# Altium project MIDIPiano.PrjPcb
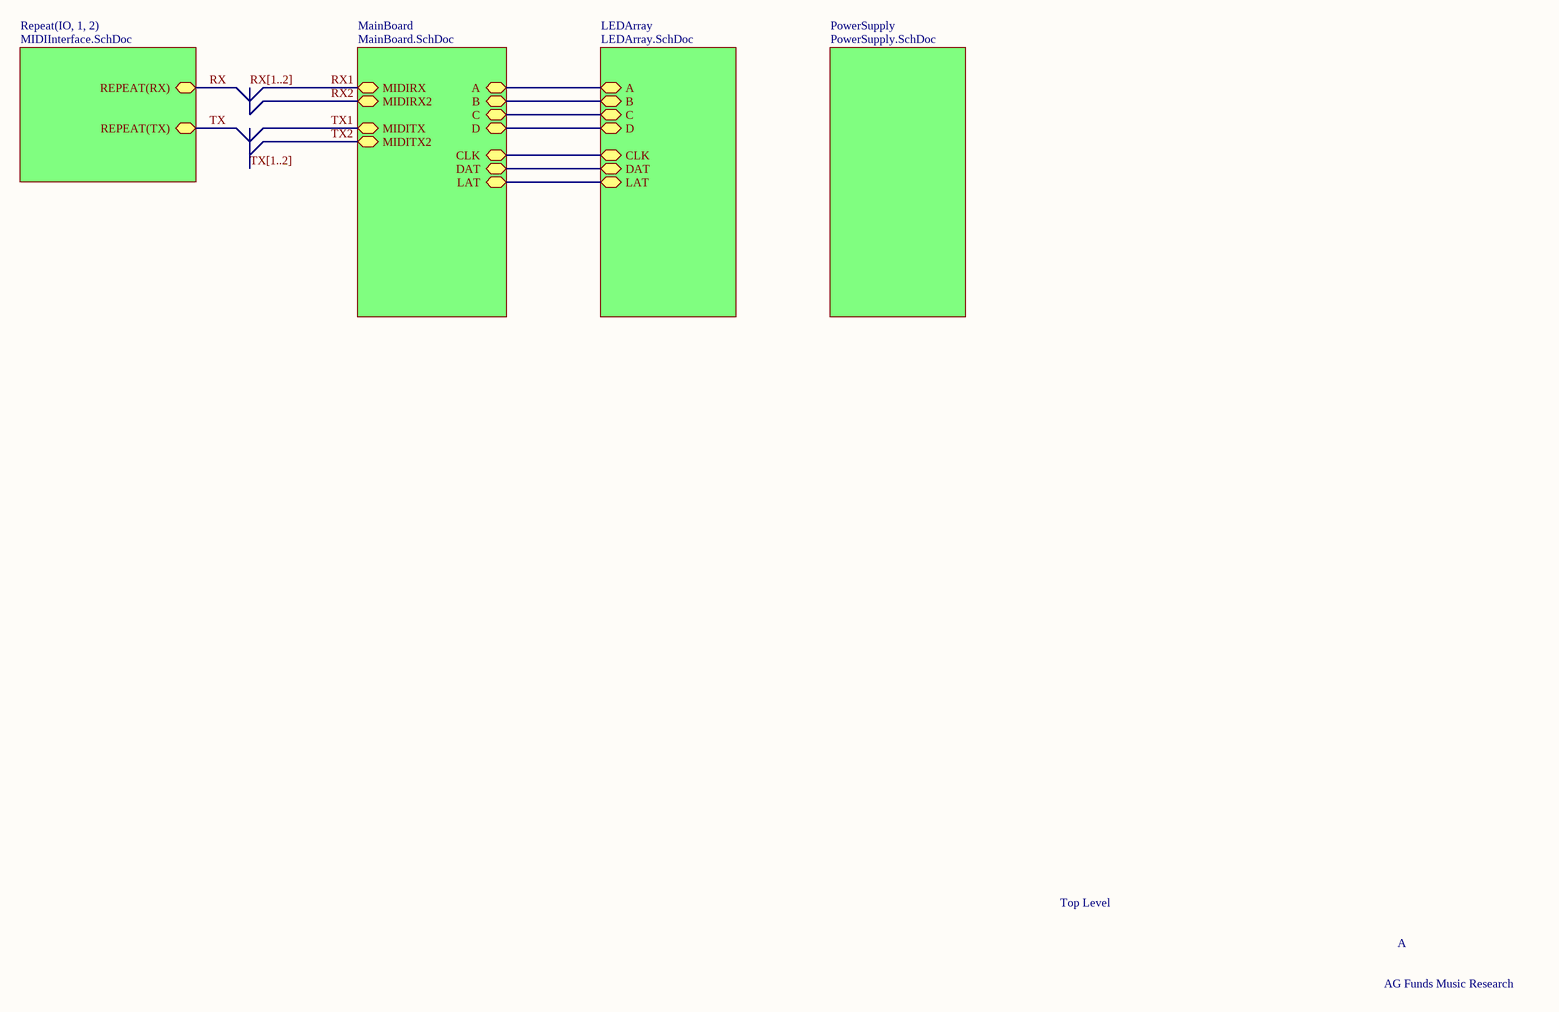
[diagram p0: MIDIPianoTop.SchDoc]
7 sheets, 250 parts. Net scope: hierarchical (ports join the sheet entries above them; power ports are global).
Board files: LEDArray8KeyRevB.PcbDoc, MainBoard.PcbDoc, LEDArrayFPC_24LED.PcbDoc
Sheets:
  MIDIPianoTop.SchDoc
    LEDArray = LEDArray.SchDoc
      LED1 = LEDElement.SchDoc
      NPNA = NPNTransistorArray.SchDoc
      NPNB = NPNTransistorArray.SchDoc
      NPNC = NPNTransistorArray.SchDoc
    MainBoard = MainBoard.SchDoc
    PowerSupply = PowerSupply.SchDoc
    IO1 = MIDIInterface.SchDoc
    IO2 = MIDIInterface.SchDoc

## Sheet MIDIPianoTop.SchDoc
size A3; DrawnBy: AG Funds Music Research Dept.; SheetNumber: 1

### Sub-sheets
LEDArray = LEDArray.SchDoc: A, B, C, D, CLK, LAT, DAT
MainBoard = MainBoard.SchDoc: A, B, C, D, CLK, LAT, DAT, MIDIRX, MIDITX, MIDIRX2, MIDITX2
PowerSupply = PowerSupply.SchDoc: no entries
Repeat(IO, 1, 2) = MIDIInterface.SchDoc: REPEAT(RX), REPEAT(TX)

### Nets
A: sheet LEDArray/A, sheet MainBoard/A
B: sheet LEDArray/B, sheet MainBoard/B
C: sheet LEDArray/C, sheet MainBoard/C
CLK: sheet LEDArray/CLK, sheet MainBoard/CLK
D: sheet LEDArray/D, sheet MainBoard/D
DAT: sheet LEDArray/DAT, sheet MainBoard/DAT
LAT: sheet LEDArray/LAT, sheet MainBoard/LAT
RX: sheet Repeat(IO, 1, 2)/REPEAT(RX)
TX: sheet Repeat(IO, 1, 2)/REPEAT(TX)

### Buses and harness runs
bus RX[1..2]
bus TX[1..2]

### Notes on the sheet
- Top Level
- A
- AG Funds Music Research

## Sheet LEDArray.SchDoc
size A2; SheetNumber: 3
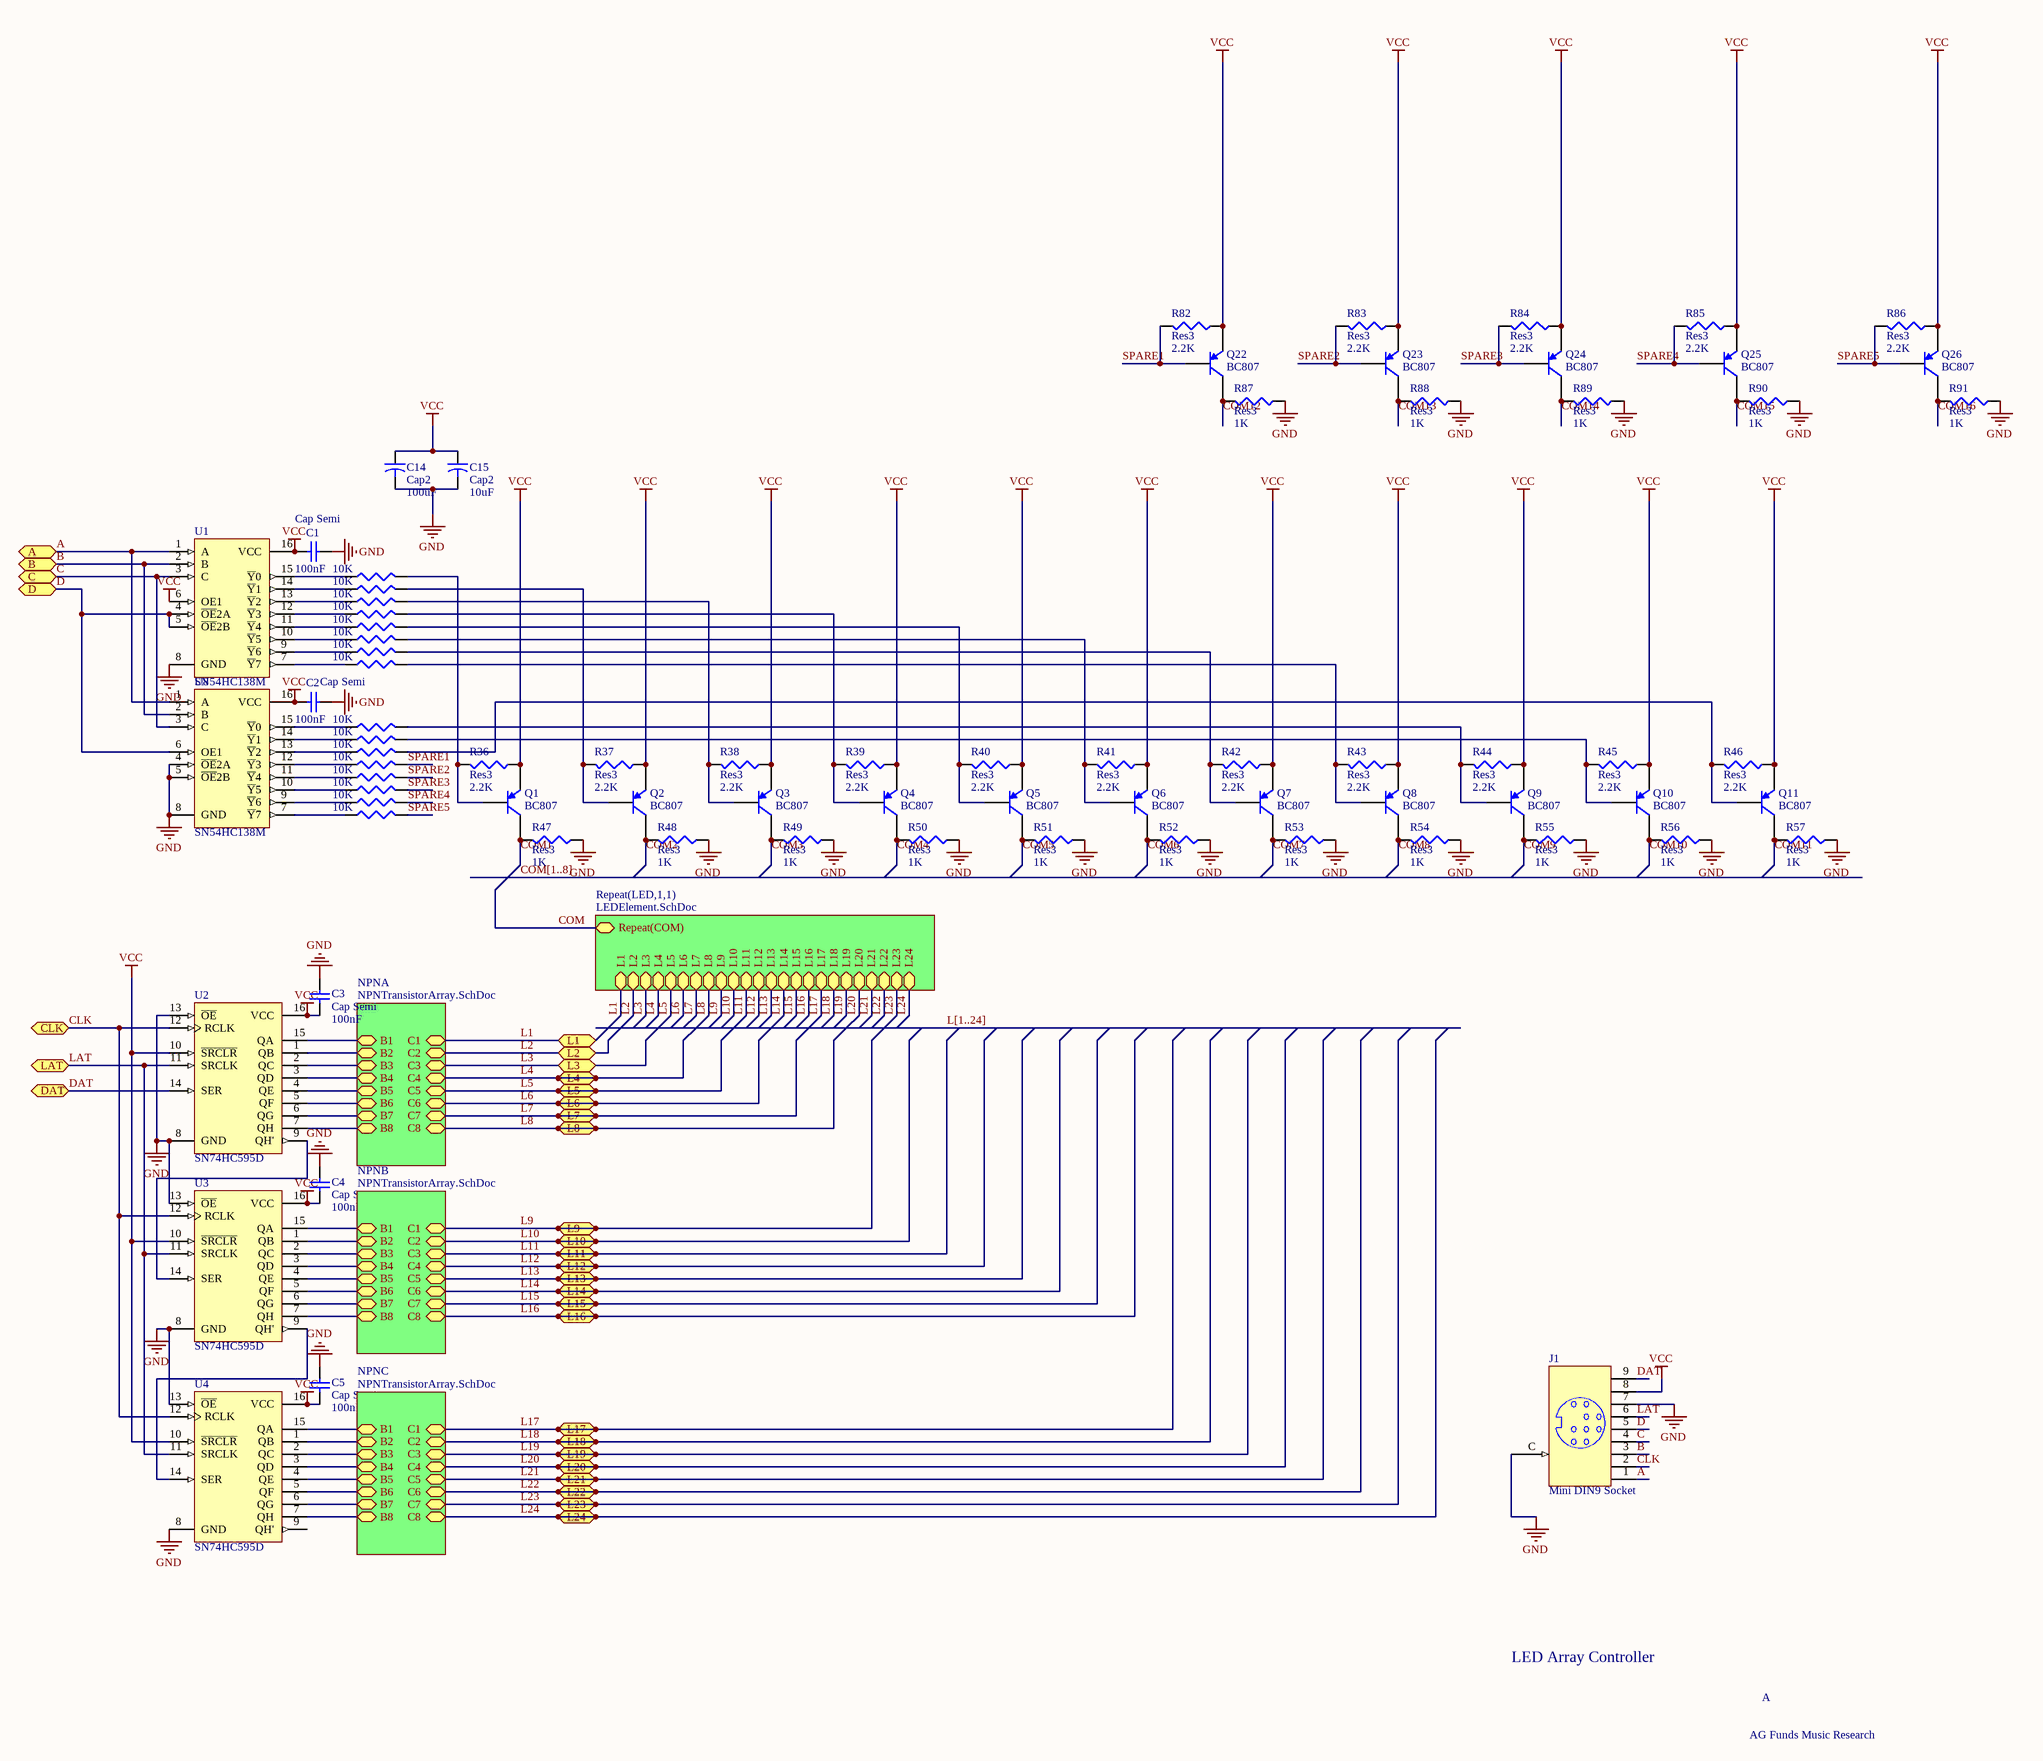
[diagram p1: LEDArray.SchDoc]

### Parts
C1  Cap Semi  value 100nF  [1608[0603]]
C2  Cap Semi  value 100nF  [1608[0603]]
C3  Cap Semi  value 100nF  [1608[0603]]
C4  Cap Semi  value 100nF  [1608[0603]]
C5  Cap Semi  value 100nF  [1608[0603]]
C14  Cap2  value 100uF  [CAPR5-4X5]
C15  Cap2  value 10uF  [CAPR5-4X5]
J1  Mini DIN9 Socket  [9miniDIN]
Q1  BC807  [SOT23-3M]
Q2  BC807  [SOT23-3M]
Q3  BC807  [SOT23-3M]
Q4  BC807  [SOT23-3M]
Q5  BC807  [SOT23-3M]
Q6  BC807  [SOT23-3M]
Q7  BC807  [SOT23-3M]
Q8  BC807  [SOT23-3M]
Q9  BC807  [SOT23-3M]
Q10  BC807  [SOT23-3M]
Q11  BC807  [SOT23-3M]
Q22  BC807  [SOT23-3M]
Q23  BC807  [SOT23-3M]
Q24  BC807  [SOT23-3M]
Q25  BC807  [SOT23-3M]
Q26  BC807  [SOT23-3M]
R25  value 10K  [J1-0603]  (hidden comment: Res3)
R26  value 10K  [J1-0603]  (hidden comment: Res3)
R27  value 10K  [J1-0603]  (hidden comment: Res3)
R28  value 10K  [J1-0603]  (hidden comment: Res3)
R29  value 10K  [J1-0603]  (hidden comment: Res3)
R30  value 10K  [J1-0603]  (hidden comment: Res3)
R31  value 10K  [J1-0603]  (hidden comment: Res3)
R32  value 10K  [J1-0603]  (hidden comment: Res3)
R33  value 10K  [J1-0603]  (hidden comment: Res3)
R34  value 10K  [J1-0603]  (hidden comment: Res3)
R35  value 10K  [J1-0603]  (hidden comment: Res3)
R36  Res3  value 2.2K  [J1-0603]
R37  Res3  value 2.2K  [J1-0603]
R38  Res3  value 2.2K  [J1-0603]
R39  Res3  value 2.2K  [J1-0603]
R40  Res3  value 2.2K  [J1-0603]
R41  Res3  value 2.2K  [J1-0603]
R42  Res3  value 2.2K  [J1-0603]
R43  Res3  value 2.2K  [J1-0603]
R44  Res3  value 2.2K  [J1-0603]
R45  Res3  value 2.2K  [J1-0603]
R46  Res3  value 2.2K  [J1-0603]
R47  Res3  value 1K  [J1-0603]
R48  Res3  value 1K  [J1-0603]
R49  Res3  value 1K  [J1-0603]
R50  Res3  value 1K  [J1-0603]
R51  Res3  value 1K  [J1-0603]
R52  Res3  value 1K  [J1-0603]
R53  Res3  value 1K  [J1-0603]
R54  Res3  value 1K  [J1-0603]
R55  Res3  value 1K  [J1-0603]
R56  Res3  value 1K  [J1-0603]
R57  Res3  value 1K  [J1-0603]
R82  Res3  value 2.2K  [J1-0603]
R83  Res3  value 2.2K  [J1-0603]
R84  Res3  value 2.2K  [J1-0603]
R85  Res3  value 2.2K  [J1-0603]
R86  Res3  value 2.2K  [J1-0603]
R87  Res3  value 1K  [J1-0603]
R88  Res3  value 1K  [J1-0603]
R89  Res3  value 1K  [J1-0603]
R90  Res3  value 1K  [J1-0603]
R91  Res3  value 1K  [J1-0603]
R92  value 10K  [J1-0603]  (hidden comment: Res3)
R93  value 10K  [J1-0603]  (hidden comment: Res3)
R94  value 10K  [J1-0603]  (hidden comment: Res3)
R95  value 10K  [J1-0603]  (hidden comment: Res3)
R96  value 10K  [J1-0603]  (hidden comment: Res3)
U1  SN54HC138M  [SOIC127P602-16BM]
U2  SN74HC595D  [D016_N]
U3  SN74HC595D  [D016_N]
U4  SN74HC595D  [D016_N]
U8  SN54HC138M  [SOIC127P602-16BM]

### Sub-sheets
NPNA = NPNTransistorArray.SchDoc: B1, B2, B3, B4, B5, B6, B7, B8, C1, C2, C3, C4, C5, C6, C7, C8
NPNB = NPNTransistorArray.SchDoc: B1, B2, B3, B4, B5, B6, B7, B8, C1, C2, C3, C4, C5, C6, C7, C8
NPNC = NPNTransistorArray.SchDoc: B1, B2, B3, B4, B5, B6, B7, B8, C1, C2, C3, C4, C5, C6, C7, C8
Repeat(LED,1,1) = LEDElement.SchDoc: L1, L2, L3, L4, L5, L6, L7, L8, L9, L10, L11, L12, L13, L14, L15, L16, L18, L17, L19, L20, L22, L21, L23, L24, Repeat(COM)

### Ports
A, B, C, CLK, D, DAT, L1, L2, L3, L4, L5, L6, L7, L8, L9, L10, L11, L12, L13, L14, L15, L16, L17, L18, L19, L20, L21, L22, L23, L24, LAT

### Nets
GND: C1.2 C2.2 C3.1 C4.1 C5.1 C14.2 C15.2 J1.7 J1.C R47.1 R48.1 R49.1 R50.1 R51.1 R52.1 R53.1 R54.1 R55.1 R56.1 R57.1 R87.1 R88.1 R89.1 R90.1 R91.1 U1.8(GND) U2.8(GND) U2.13(~{OE}) U3.8(GND) U3.13(~{OE}) U4.8(GND) U4.13(~{OE}) U8.4(~{OE}2A) U8.5(~{OE}2B) U8.8(GND)
VCC: C1.1 C2.1 C3.2 C4.2 C5.2 C14.1 C15.1 J1.8 Q1.2(E) Q2.2(E) Q3.2(E) Q4.2(E) Q5.2(E) Q6.2(E) Q7.2(E) Q8.2(E) Q9.2(E) Q10.2(E) Q11.2(E) Q22.2(E) Q23.2(E) Q24.2(E) Q25.2(E) Q26.2(E) R36.1 R37.1 R38.1 R39.1 R40.1 R41.1 R42.1 R43.1 R44.1 R45.1 R46.1 R82.1 R83.1 R84.1 R85.1 R86.1 U1.6(OE1) U1.16(VCC) U2.10(~{SRCLR}) U2.16(VCC) U3.10(~{SRCLR}) U3.16(VCC) U4.10(~{SRCLR}) U4.16(VCC) U8.16(VCC)
A: J1.1 U1.1(A) U8.1(A) ; port A
B: J1.3 U1.2(B) U8.2(B) ; port B
B1: U2.15(QA) ; sheet NPNA/B1
B1: U3.15(QA) ; sheet NPNB/B1  [a separate net that carries the same name]
B1: U4.15(QA) ; sheet NPNC/B1  [a separate net that carries the same name]
B2: U2.1(QB) ; sheet NPNA/B2
B2: U3.1(QB) ; sheet NPNB/B2  [a separate net that carries the same name]
B2: U4.1(QB) ; sheet NPNC/B2  [a separate net that carries the same name]
B3: U2.2(QC) ; sheet NPNA/B3
B3: U3.2(QC) ; sheet NPNB/B3  [a separate net that carries the same name]
B3: U4.2(QC) ; sheet NPNC/B3  [a separate net that carries the same name]
B4: U2.3(QD) ; sheet NPNA/B4
B4: U3.3(QD) ; sheet NPNB/B4  [a separate net that carries the same name]
B4: U4.3(QD) ; sheet NPNC/B4  [a separate net that carries the same name]
B5: U2.4(QE) ; sheet NPNA/B5
B5: U3.4(QE) ; sheet NPNB/B5  [a separate net that carries the same name]
B5: U4.4(QE) ; sheet NPNC/B5  [a separate net that carries the same name]
B6: U2.5(QF) ; sheet NPNA/B6
B6: U3.5(QF) ; sheet NPNB/B6  [a separate net that carries the same name]
B6: U4.5(QF) ; sheet NPNC/B6  [a separate net that carries the same name]
B7: U2.6(QG) ; sheet NPNA/B7
B7: U3.6(QG) ; sheet NPNB/B7  [a separate net that carries the same name]
B7: U4.6(QG) ; sheet NPNC/B7  [a separate net that carries the same name]
B8: U2.7(QH) ; sheet NPNA/B8
B8: U3.7(QH) ; sheet NPNB/B8  [a separate net that carries the same name]
B8: U4.7(QH) ; sheet NPNC/B8  [a separate net that carries the same name]
C: J1.4 U1.3(C) U8.3(C) ; port C
CLK: J1.2 U2.12(RCLK) U3.12(RCLK) U4.12(RCLK) ; port CLK
COM: sheet Repeat(LED,1,1)/Repeat(COM)
COM1: Q1.3(C) R47.2
COM2: Q2.3(C) R48.2
COM3: Q3.3(C) R49.2
COM4: Q4.3(C) R50.2
COM5: Q5.3(C) R51.2
COM6: Q6.3(C) R52.2
COM7: Q7.3(C) R53.2
COM8: Q8.3(C) R54.2
COM9: Q9.3(C) R55.2
COM10: Q10.3(C) R56.2
COM11: Q11.3(C) R57.2
COM12: Q22.3(C) R87.2
COM13: Q23.3(C) R88.2
COM14: Q24.3(C) R89.2
COM15: Q25.3(C) R90.2
COM16: Q26.3(C) R91.2
D: J1.5 U1.4(~{OE}2A) U1.5(~{OE}2B) U8.6(OE1) ; port D
DAT: J1.9 U2.14(SER) ; port DAT
L1: port L1, sheet Repeat(LED,1,1)/L1, sheet NPNA/C1
L2: port L2, sheet Repeat(LED,1,1)/L2, sheet NPNA/C2
L3: port L3, sheet Repeat(LED,1,1)/L3, sheet NPNA/C3
L4: port L4, sheet Repeat(LED,1,1)/L4, sheet NPNA/C4
L5: port L5, sheet Repeat(LED,1,1)/L5, sheet NPNA/C5
L6: port L6, sheet Repeat(LED,1,1)/L6, sheet NPNA/C6
L7: port L7, sheet Repeat(LED,1,1)/L7, sheet NPNA/C7
L8: port L8, sheet Repeat(LED,1,1)/L8, sheet NPNA/C8
L9: port L9, sheet Repeat(LED,1,1)/L9, sheet NPNB/C1
L10: port L10, sheet Repeat(LED,1,1)/L10, sheet NPNB/C2
L11: port L11, sheet Repeat(LED,1,1)/L11, sheet NPNB/C3
L12: port L12, sheet Repeat(LED,1,1)/L12, sheet NPNB/C4
L13: port L13, sheet Repeat(LED,1,1)/L13, sheet NPNB/C5
L14: port L14, sheet Repeat(LED,1,1)/L14, sheet NPNB/C6
L15: port L15, sheet Repeat(LED,1,1)/L15, sheet NPNB/C7
L16: port L16, sheet Repeat(LED,1,1)/L16, sheet NPNB/C8
L17: port L17, sheet Repeat(LED,1,1)/L17, sheet NPNC/C1
L18: port L18, sheet Repeat(LED,1,1)/L18, sheet NPNC/C2
L19: port L19, sheet Repeat(LED,1,1)/L19, sheet NPNC/C3
L20: port L20, sheet Repeat(LED,1,1)/L20, sheet NPNC/C4
L21: port L21, sheet Repeat(LED,1,1)/L21, sheet NPNC/C5
L22: port L22, sheet Repeat(LED,1,1)/L22, sheet NPNC/C6
L23: port L23, sheet Repeat(LED,1,1)/L23, sheet NPNC/C7
L24: port L24, sheet Repeat(LED,1,1)/L24, sheet NPNC/C8
LAT: J1.6 U2.11(SRCLK) U3.11(SRCLK) U4.11(SRCLK) ; port LAT
SPARE1: Q22.1(B) R82.2 R92.2
SPARE2: Q23.1(B) R83.2 R93.2
SPARE3: Q24.1(B) R84.2 R94.2
SPARE4: Q25.1(B) R85.2 R95.2
SPARE5: Q26.1(B) R86.2 R96.2
NetQ1_1: Q1.1(B) R25.2 R36.2
NetQ2_1: Q2.1(B) R26.2 R37.2
NetQ3_1: Q3.1(B) R27.2 R38.2
NetQ4_1: Q4.1(B) R28.2 R39.2
NetQ5_1: Q5.1(B) R29.2 R40.2
NetQ6_1: Q6.1(B) R30.2 R41.2
NetQ7_1: Q7.1(B) R31.2 R42.2
NetQ8_1: Q8.1(B) R32.2 R43.2
NetQ9_1: Q9.1(B) R33.2 R44.2
NetQ10_1: Q10.1(B) R34.2 R45.2
NetQ11_1: Q11.1(B) R35.2 R46.2
NetR25_1: R25.1 U1.15(~{Y}0)
NetR26_1: R26.1 U1.14(~{Y}1)
NetR27_1: R27.1 U1.13(~{Y}2)
NetR28_1: R28.1 U1.12(~{Y}3)
NetR29_1: R29.1 U1.11(~{Y}4)
NetR30_1: R30.1 U1.10(~{Y}5)
NetR31_1: R31.1 U1.9(~{Y}6)
NetR32_1: R32.1 U1.7(~{Y}7)
NetR33_1: R33.1 U8.15(~{Y}0)
NetR34_1: R34.1 U8.14(~{Y}1)
NetR35_1: R35.1 U8.13(~{Y}2)
NetR92_1: R92.1 U8.12(~{Y}3)
NetR93_1: R93.1 U8.11(~{Y}4)
NetR94_1: R94.1 U8.10(~{Y}5)
NetR95_1: R95.1 U8.9(~{Y}6)
NetR96_1: R96.1 U8.7(~{Y}7)
NetU2_9: U2.9(QH') U3.14(SER)
NetU3_9: U3.9(QH') U4.14(SER)

Not connected (* = marked no-connect by the designer): U4 9(QH')

### Buses and harness runs
bus COM[1..8]
bus L[1..24]

### Notes on the sheet
- LED Array Controller
- A
- AG Funds Music Research

### Library data of the parts
C1-C5 = Cap Semi: Capacitor (Semiconductor SIM Model); Published: 8-Jun-2000; LatestRevisionDate: 29-May-2009; LatestRevisionNote: IPC-7351 Footprint Added.; PackageReference: C1206; Publisher: Altium Limited; PackageDescription: Chip Capacitor
C14 C15 = Cap2: Capacitor; Published: 23-Sep-2002; PackageReference: CAPR5-4X5; Publisher: Altium Limited; PackageDescription: Capacitor; 2 Leads
J1 = mDIN9: CUI Inc. MD-90S MINIDIN9 PCB Mount Socket; Published: 17-Dec-2003; Publisher: Altium Limited; ComponentLink1Description: Manufacturer Link; ComponentLink1URL: http://www.oupiin.com/prodindx.html#Headers
Q1-Q11 Q22-Q26 = BC807: BC807 PNP General Purpose Amplifier
R25-R57 R82-R96 = Res3: Resistor; Published: 8-Jun-2000; LatestRevisionDate: 29-May-2009; LatestRevisionNote: IPC-7351 Footprint Added.; PackageReference: J1-0603; Publisher: Altium Limited; PackageDescription: Chip Resistor
U1 U8 = SN54HC138J: 3-Line to 8-Line Decoder / Demultiplexer; Published: 8-Jun-2000; LatestRevisionDate: 04-Mar-2005; LatestRevisionNote: Stylized 3D Model Added.; DatasheetVersion: May-1997; PackageVersion: Jun-1999; PackageReference: J016; Publisher: Altium Limited; PackageDescription: DIP; 16 Leads; Row Spacing 7.62 mm; Pitch 2.54 mm; ComponentLink1Description: Manufacturer Link; ComponentLink1URL: http://www.ti.com/; ComponentLink2Description: Datasheet; ComponentLink2URL: http://www-s.ti.com/sc/ds/sn74hc138.pdf
U2-U4 = SN74HC595D: 8-Bit Shift Register with 3-State Output Registers; Published: 8-Jun-2000; LatestRevisionDate: 13-Apr-2006; LatestRevisionNote: IPC-7351 Footprint Added.; DatasheetVersion: May-1997; PackageVersion: Jan-1998; PackageReference: D016; Publisher: Altium Limited; PackageDescription: 16-Pin Small Outline Integrated Circuit 1.27 mm Pitch; Code_IPC: SOIC127P600-16; ComponentLink1Description: Manufacturer Link; ComponentLink1URL: http://www.ti.com/; ComponentLink2Description: Datasheet; ComponentLink2URL: http://www-s.ti.com/sc/ds/sn74hc595.pdf

## Sheet LEDElement.SchDoc
size A3
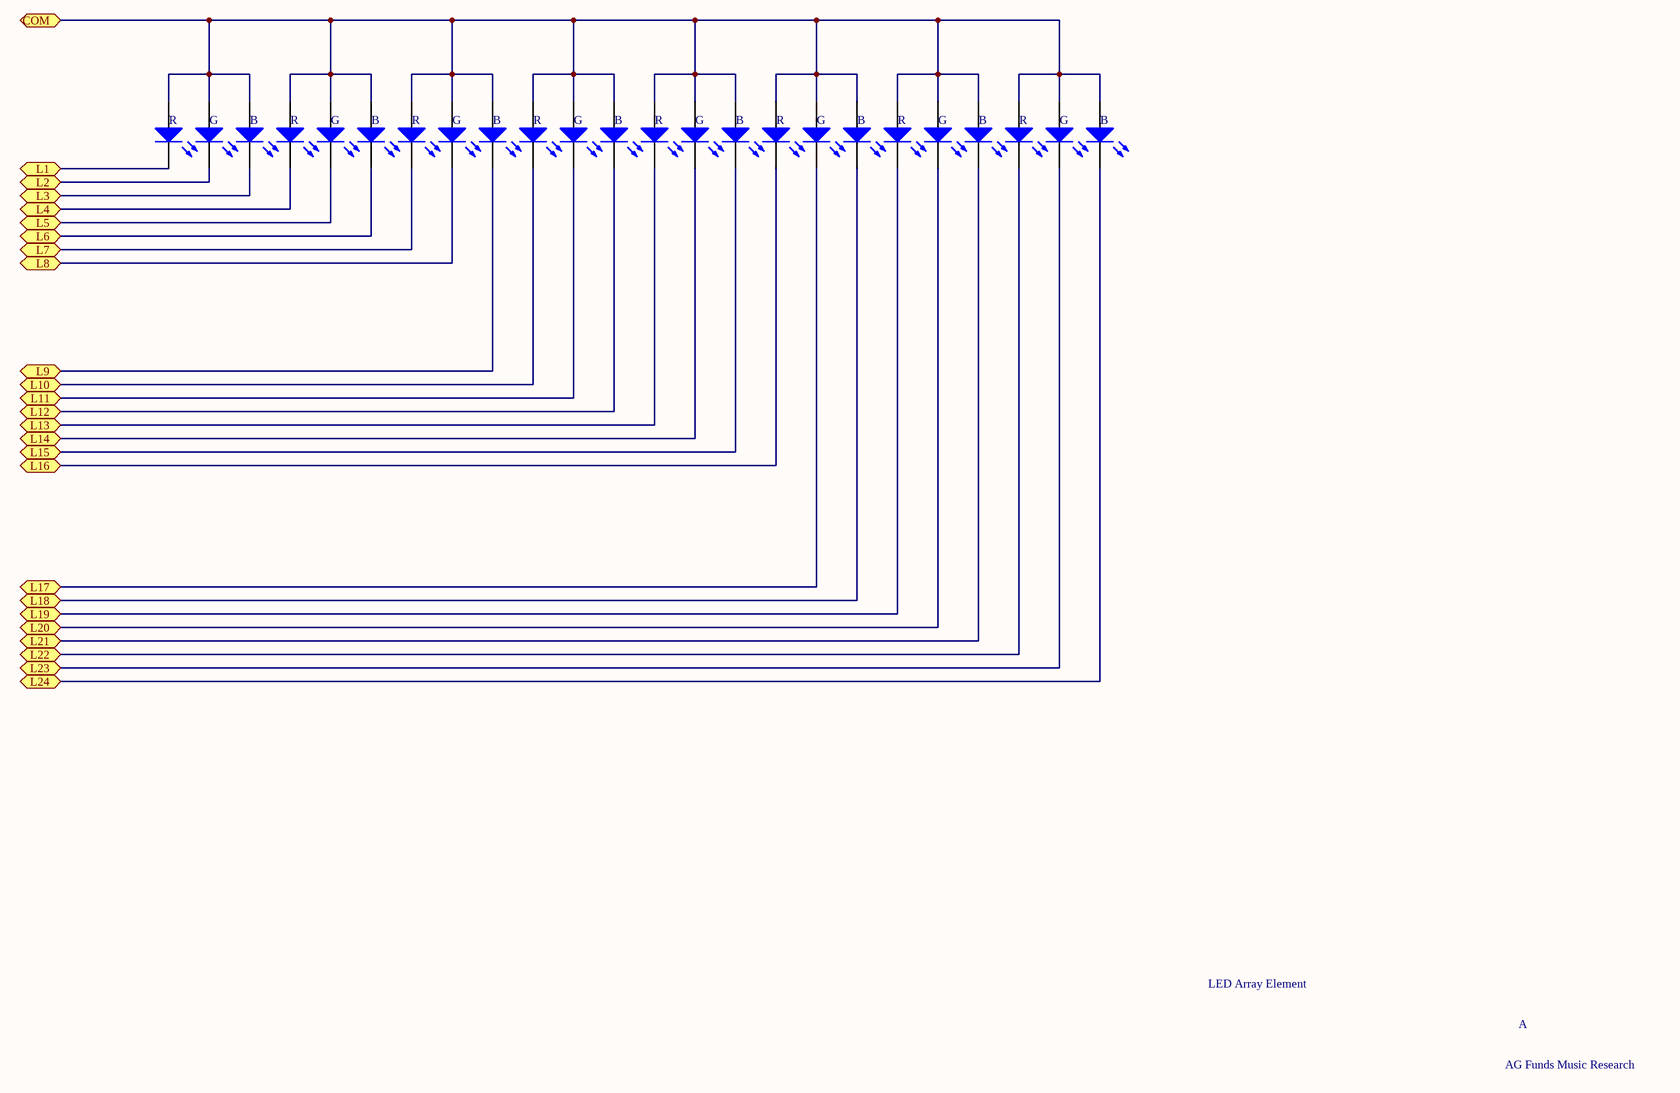
[diagram p2: LEDElement.SchDoc]

### Parts
LED1  5050RGBLED  [5050 cRGBLED]  (value not drawn)
LED2  5050RGBLED  [5050 cRGBLED]  (value not drawn)
LED3  5050RGBLED  [5050 cRGBLED]  (value not drawn)
LED4  5050RGBLED  [5050 cRGBLED]  (value not drawn)
LED5  5050RGBLED  [5050 cRGBLED]  (value not drawn)
LED6  5050RGBLED  [5050 cRGBLED]  (value not drawn)
LED7  5050RGBLED  [5050 cRGBLED]  (value not drawn)
LED8  5050RGBLED  [5050 cRGBLED]  (value not drawn)

### Ports
COM, L1, L2, L3, L4, L5, L6, L7, L8, L9, L10, L11, L12, L13, L14, L15, L16, L17, L18, L19, L20, L21, L22, L23, L24

### Nets
COM1: LED1.1(A) LED1.3(A) LED1.5(A) LED2.1(A) LED2.3(A) LED2.5(A) LED3.1(A) LED3.3(A) LED3.5(A) LED4.1(A) LED4.3(A) LED4.5(A) LED5.1(A) LED5.3(A) LED5.5(A) LED6.1(A) LED6.3(A) LED6.5(A) LED7.1(A) LED7.3(A) LED7.5(A) LED8.1(A) LED8.3(A) LED8.5(A) ; port COM
L1: LED1.6(K) ; port L1
L2: LED1.4(K) ; port L2
L3: LED1.2(K) ; port L3
L4: LED2.6(K) ; port L4
L5: LED2.4(K) ; port L5
L6: LED2.2(K) ; port L6
L7: LED3.6(K) ; port L7
L8: LED3.4(K) ; port L8
L9: LED3.2(K) ; port L9
L10: LED4.6(K) ; port L10
L11: LED4.4(K) ; port L11
L12: LED4.2(K) ; port L12
L13: LED5.6(K) ; port L13
L14: LED5.4(K) ; port L14
L15: LED5.2(K) ; port L15
L16: LED6.6(K) ; port L16
L17: LED6.4(K) ; port L17
L18: LED6.2(K) ; port L18
L19: LED7.6(K) ; port L19
L20: LED7.4(K) ; port L20
L21: LED7.2(K) ; port L21
L22: LED8.6(K) ; port L22
L23: LED8.4(K) ; port L23
L24: LED8.2(K) ; port L24

### Notes on the sheet
- LED Array Element
- A
- AG Funds Music Research
- (in symbol 5050RGBLED) R; G; B

### Library data of the parts
LED1-LED8 = 5050RGBLED: 5050 RGB LED; Published: 8-Jun-2000; LatestRevisionDate: 08-Jul-2005; LatestRevisionNote: Mech Layer 1 removed.; PackageReference: LED-0; Publisher: Altium Limited; PackageDescription: LED; 2 Leads

## Sheet NPNTransistorArray.SchDoc
size A3
Used 3 times, as channels LEDArray/NPNA, LEDArray/NPNB, LEDArray/NPNC. Parts and nets are listed once, with the designators drawn on the sheet.
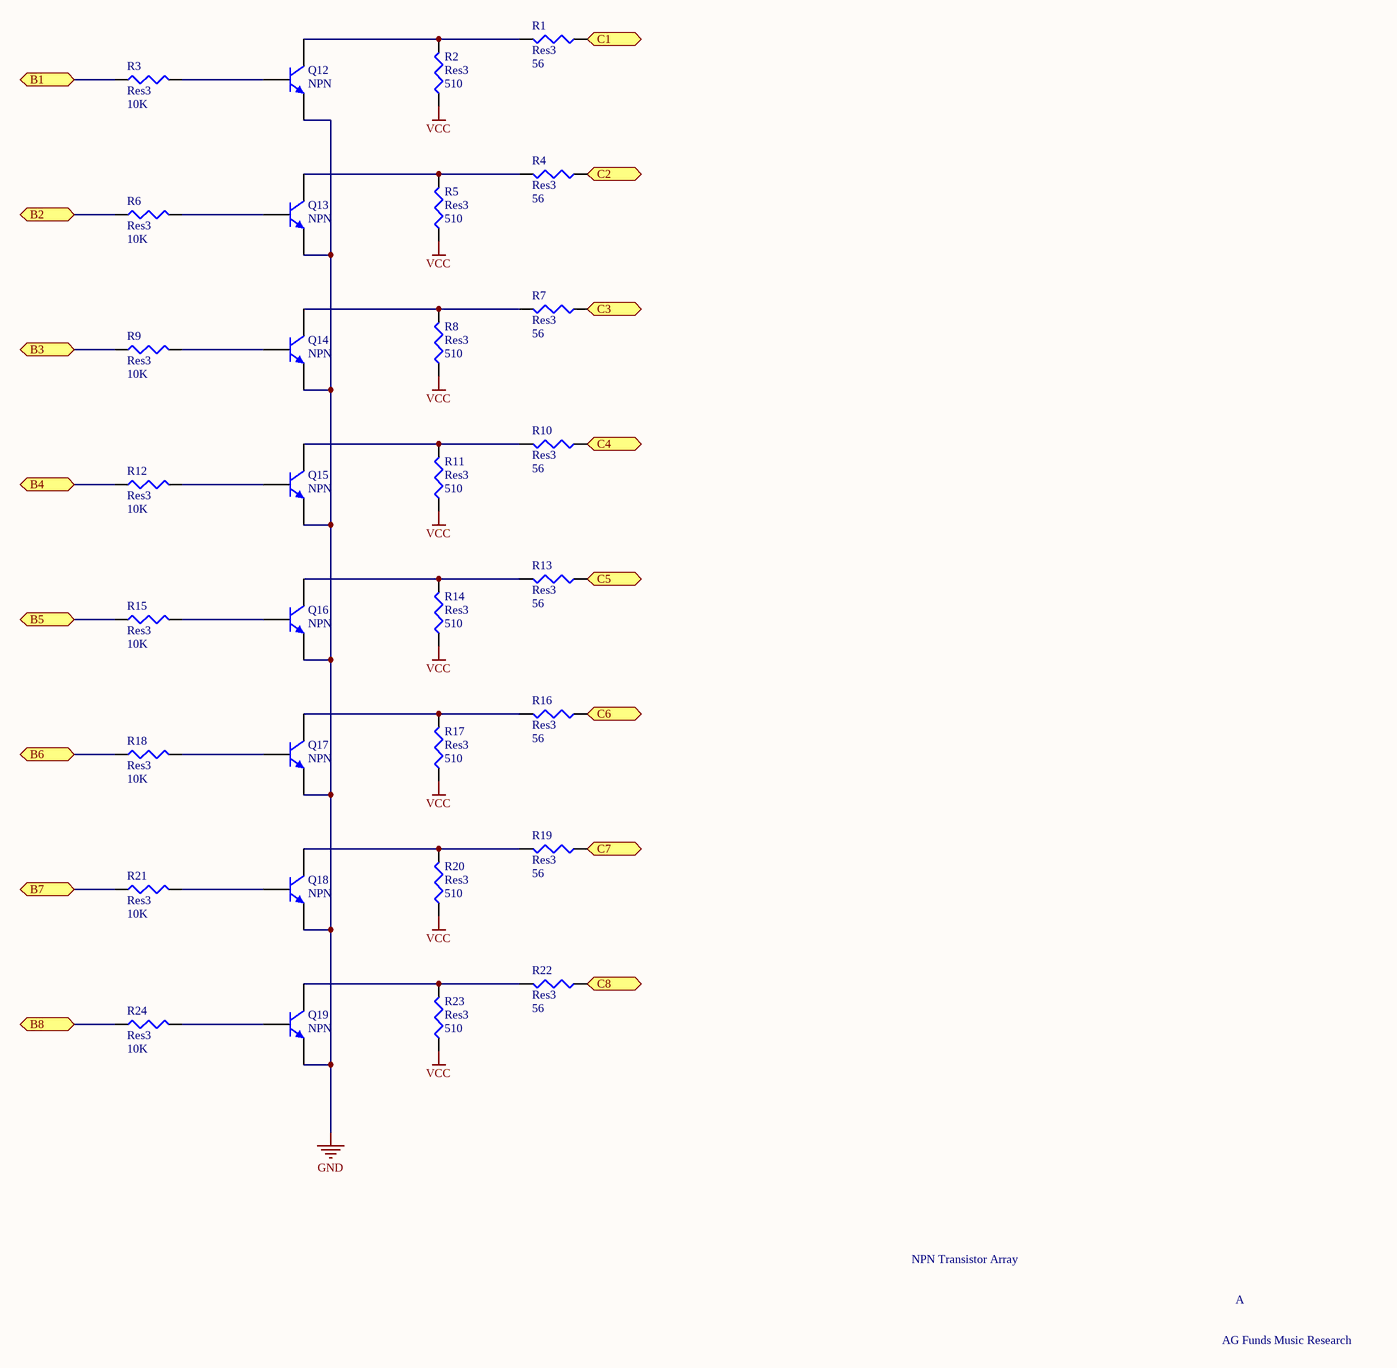
[diagram p3: NPNTransistorArray.SchDoc]

### Parts
Q12  NPN  [SOT95P230-3N]
Q13  NPN  [SOT95P230-3N]
Q14  NPN  [SOT95P230-3N]
Q15  NPN  [SOT95P230-3N]
Q16  NPN  [SOT95P230-3N]
Q17  NPN  [SOT95P230-3N]
Q18  NPN  [SOT95P230-3N]
Q19  NPN  [SOT95P230-3N]
R1  Res3  value 56  [J1-0603]
R2  Res3  value 510  [J1-0603]
R3  Res3  value 10K  [J1-0603]
R4  Res3  value 56  [J1-0603]
R5  Res3  value 510  [J1-0603]
R6  Res3  value 10K  [J1-0603]
R7  Res3  value 56  [J1-0603]
R8  Res3  value 510  [J1-0603]
R9  Res3  value 10K  [J1-0603]
R10  Res3  value 56  [J1-0603]
R11  Res3  value 510  [J1-0603]
R12  Res3  value 10K  [J1-0603]
R13  Res3  value 56  [J1-0603]
R14  Res3  value 510  [J1-0603]
R15  Res3  value 10K  [J1-0603]
R16  Res3  value 56  [J1-0603]
R17  Res3  value 510  [J1-0603]
R18  Res3  value 10K  [J1-0603]
R19  Res3  value 56  [J1-0603]
R20  Res3  value 510  [J1-0603]
R21  Res3  value 10K  [J1-0603]
R22  Res3  value 56  [J1-0603]
R23  Res3  value 510  [J1-0603]
R24  Res3  value 10K  [J1-0603]

### Ports
B1, B2, B3, B4, B5, B6, B7, B8, C1, C2, C3, C4, C5, C6, C7, C8

### Nets
GND: Q12.3(E) Q13.3(E) Q14.3(E) Q15.3(E) Q16.3(E) Q17.3(E) Q18.3(E) Q19.3(E)
VCC: R2.1 R5.1 R8.1 R11.1 R14.1 R17.1 R20.1 R23.1
B1: R3.1 ; port B1
B2: R6.1 ; port B2
B3: R9.1 ; port B3
B4: R12.1 ; port B4
B5: R15.1 ; port B5
B6: R18.1 ; port B6
B7: R21.1 ; port B7
B8: R24.1 ; port B8
C1: R1.1 ; port C1
C2: R4.1 ; port C2
C3: R7.1 ; port C3
C4: R10.1 ; port C4
C5: R13.1 ; port C5
C6: R16.1 ; port C6
C7: R19.1 ; port C7
C8: R22.1 ; port C8
NetQ12_1: Q12.1(C) R1.2 R2.2
NetQ12_2: Q12.2(B) R3.2
NetQ13_1: Q13.1(C) R4.2 R5.2
NetQ13_2: Q13.2(B) R6.2
NetQ14_1: Q14.1(C) R7.2 R8.2
NetQ14_2: Q14.2(B) R9.2
NetQ15_1: Q15.1(C) R10.2 R11.2
NetQ15_2: Q15.2(B) R12.2
NetQ16_1: Q16.1(C) R13.2 R14.2
NetQ16_2: Q16.2(B) R15.2
NetQ17_1: Q17.1(C) R16.2 R17.2
NetQ17_2: Q17.2(B) R18.2
NetQ18_1: Q18.1(C) R19.2 R20.2
NetQ18_2: Q18.2(B) R21.2
NetQ19_1: Q19.1(C) R22.2 R23.2
NetQ19_2: Q19.2(B) R24.2

### Channels
LEDArray/NPNA: designators end in _NPNA; ports B1=B1 B2=B2 B3=B3 B4=B4 B5=B5 B6=B6 B7=B7 B8=B8 C1=L1 C2=L2 C3=L3 C4=L4 C5=L5 C6=L6 C7=L7 C8=L8
LEDArray/NPNB: designators end in _NPNB; ports B1=B1 B2=B2 B3=B3 B4=B4 B5=B5 B6=B6 B7=B7 B8=B8 C1=L9 C2=L10 C3=L11 C4=L12 C5=L13 C6=L14 C7=L15 C8=L16
LEDArray/NPNC: designators end in _NPNC; ports B1=B1 B2=B2 B3=B3 B4=B4 B5=B5 B6=B6 B7=B7 B8=B8 C1=L17 C2=L18 C3=L19 C4=L20 C5=L21 C6=L22 C7=L23 C8=L24

### Notes on the sheet
- NPN Transistor Array
- A
- AG Funds Music Research

### Library data of the parts
Q12-Q19 = NPN: BC817/BC818 SMD NPN Bipolar Transistor; Published: 8-Jun-2000; LatestRevisionDate: 17-Jul-2002; LatestRevisionNote: Re-released for DXP Platform.; PackageReference: TO-226-AA; Publisher: Altium Limited; PackageDescription: TO, Flat Index; 3 In-Line, Axial Leads; Body Dia. 4.8mm; Leads 0.55 x 0.51 mm (max); Code_JEDEC: TO-226-AA
R1-R24 = Res3: Resistor; Published: 8-Jun-2000; LatestRevisionDate: 29-May-2009; LatestRevisionNote: IPC-7351 Footprint Added.; PackageReference: J1-0603; Publisher: Altium Limited; PackageDescription: Chip Resistor

## Sheet MainBoard.SchDoc
size A3; SheetNumber: 2
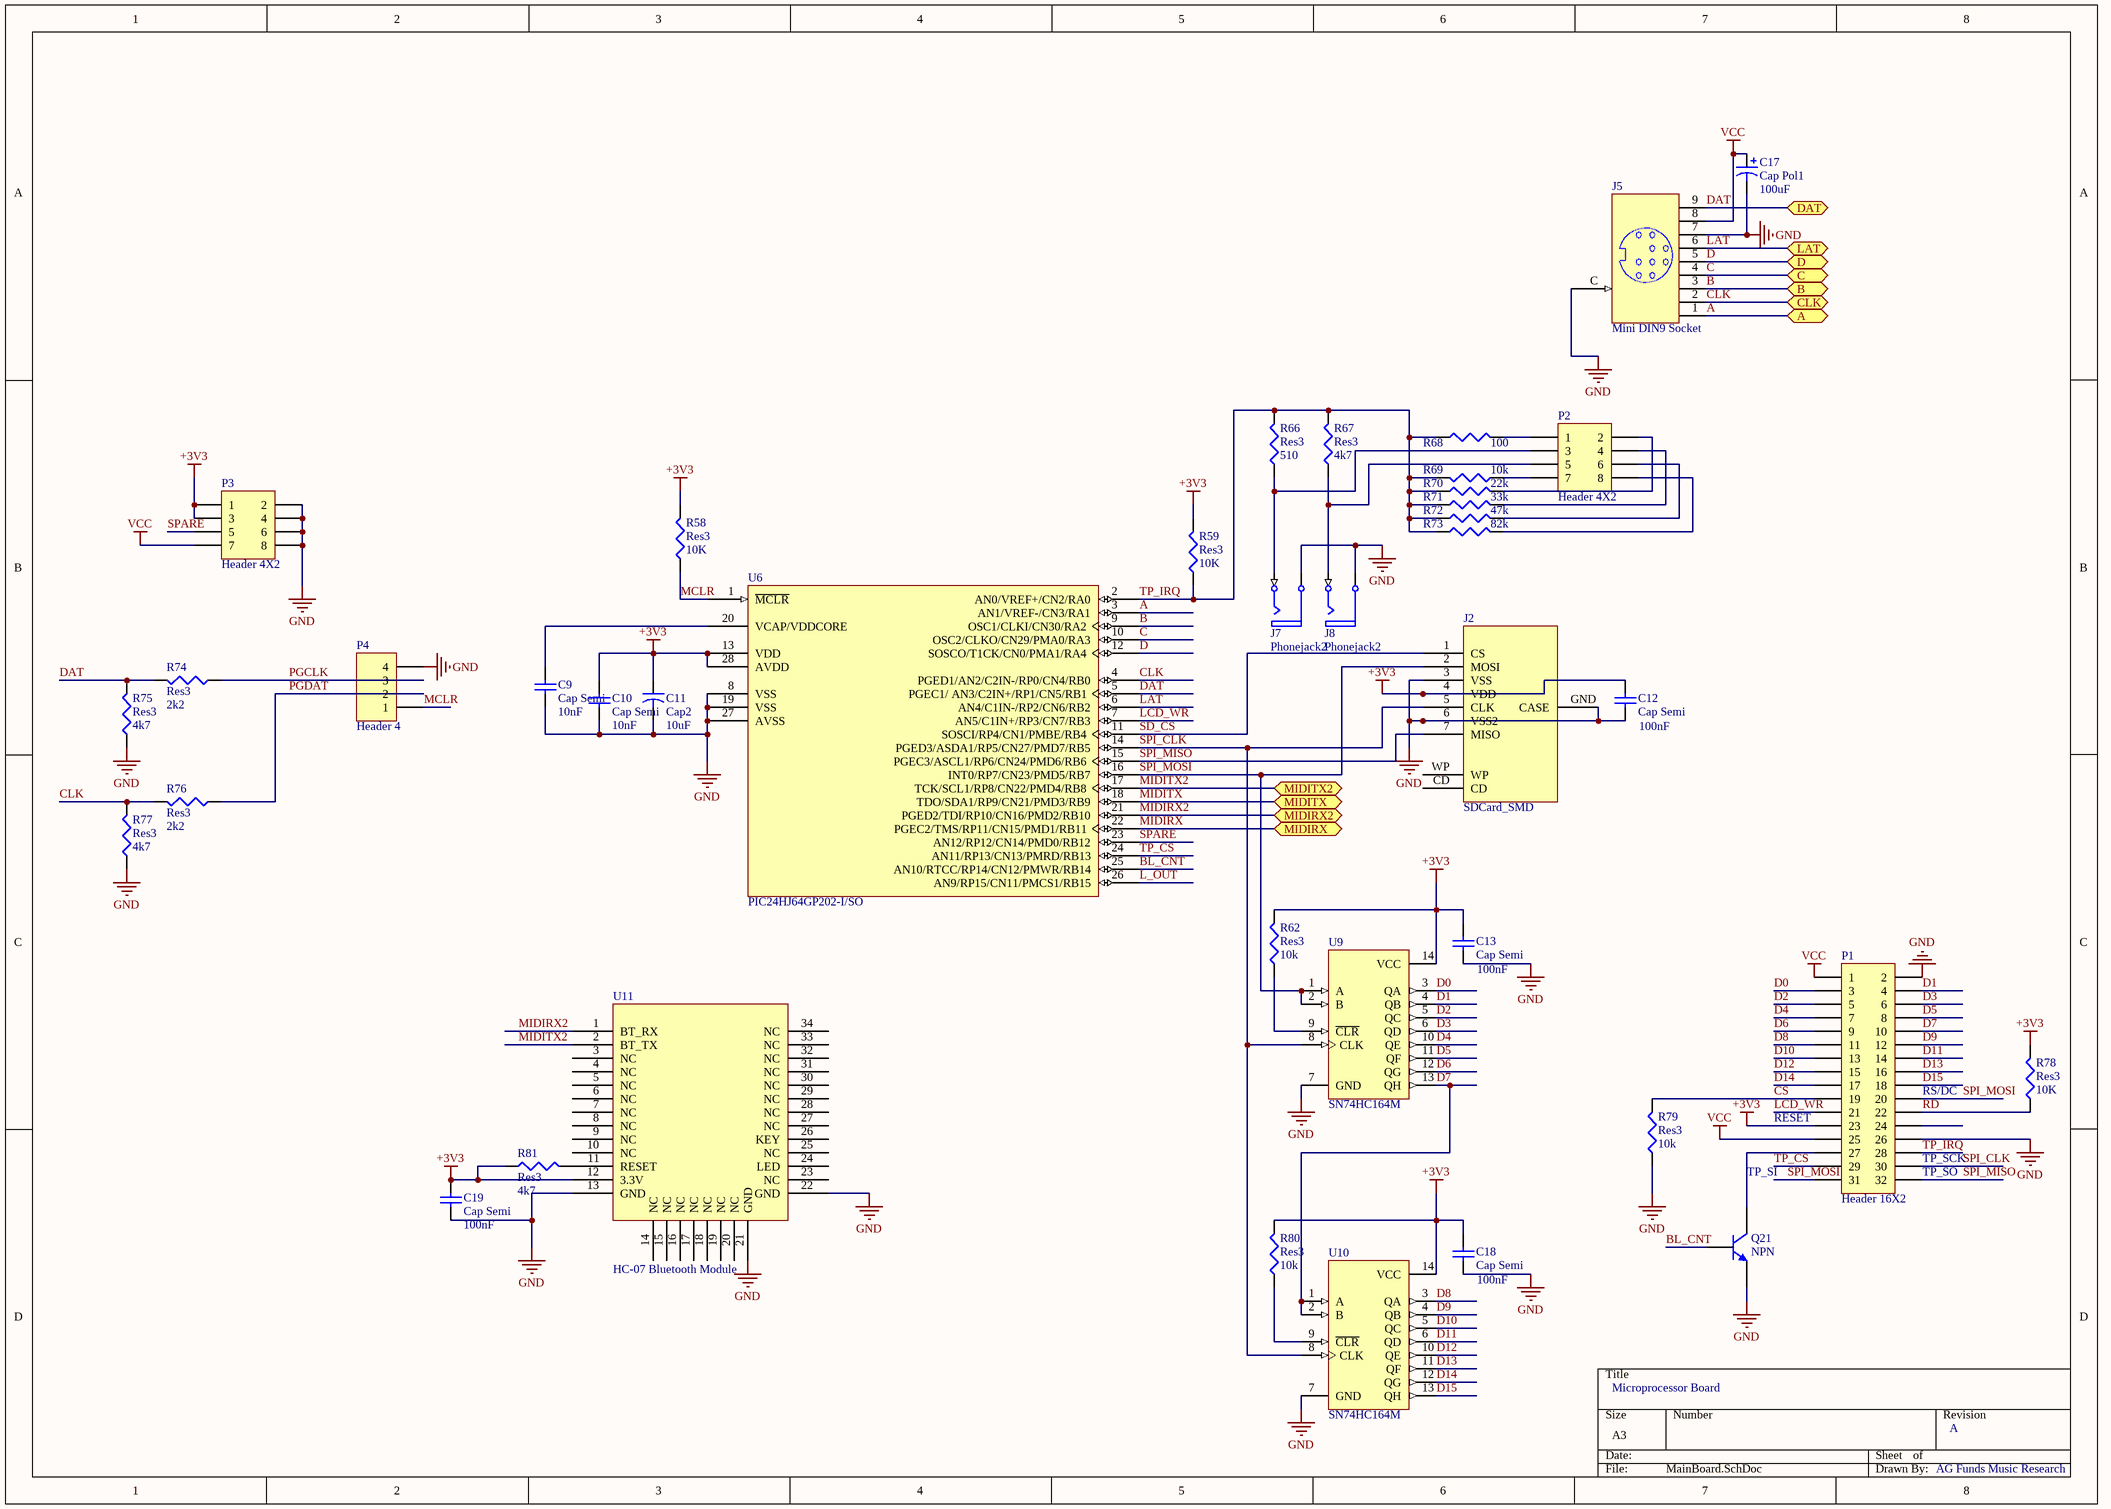
[diagram p4: MainBoard.SchDoc]

### Parts
C9  Cap Semi  value 10nF  [1608[0603]]
C10  Cap Semi  value 10nF  [1608[0603]]
C11  Cap2  value 10uF  [CAPR5-4X5]
C12  Cap Semi  value 100nF  [1608[0603]]
C13  Cap Semi  value 100nF  [1608[0603]]
C17  Cap Pol1  value 100uF  [RB7.6-15]
C18  Cap Semi  value 100nF  [1608[0603]]
C19  Cap Semi  value 100nF  [1608[0603]]
J2  SDCard_SMD  [SDCard]
J5  Mini DIN9 Socket  [9miniDIN]
J7  Phonejack2  [RN111PC]
J8  Phonejack2  [RN111PC]
P1  Header 16X2  [HDR2X16]
P2  Header 4X2  [HDR2X4]
P3  Header 4X2  [HDR2X4]
P4  Header 4  [HDR1X4]
Q21  NPN  [SOT95P230-3N]
R58  Res3  value 10K  [J1-0603]
R59  Res3  value 10K  [J1-0603]
R62  Res3  value 10k  [J1-0603]
R66  Res3  value 510  [J1-0603]
R67  Res3  value 4k7  [J1-0603]
R68  value 100  [J1-0603]  (hidden comment: Res3)
R69  value 10k  [J1-0603]  (hidden comment: Res3)
R70  value 22k  [J1-0603]  (hidden comment: Res3)
R71  value 33k  [J1-0603]  (hidden comment: Res3)
R72  value 47k  [J1-0603]  (hidden comment: Res3)
R73  value 82k  [J1-0603]  (hidden comment: Res3)
R74  Res3  value 2k2  [J1-0603]
R75  Res3  value 4k7  [J1-0603]
R76  Res3  value 2k2  [J1-0603]
R77  Res3  value 4k7  [J1-0603]
R78  Res3  value 10K  [J1-0603]
R79  Res3  value 10k  [J1-0603]
R80  Res3  value 10k  [J1-0603]
R81  Res3  value 4k7  [J1-0603]
U6  PIC24HJ64GP202-I/SO  [SOIC-SO28_N]
U9  SN74HC164M  [SOIC127P600-14AM]
U10  SN74HC164M  [SOIC127P600-14AM]
U11  HC-07 Bluetooth Module  [BTModule]

### Ports
A, B, C, CLK, D, DAT, LAT, MIDIRX, MIDIRX2, MIDITX, MIDITX2

### Nets
+3V3: C10.2 C11.1 C12.2 C13.2 C18.2 C19.2 J2.4(VDD) P1.23 P3.1 P3.3 R58.2 R59.2 R62.2 R78.2 R80.2 R81.1 U6.13(VDD) U6.28(AVDD) U9.14(VCC) U10.14(VCC) U11.12(3.3V)
GND: C9.1 C10.1 C11.2 C12.1 C13.1 C17.2 C18.1 C19.1 J2.3(VSS) J2.6(VSS2) J2.GND(CASE) J5.7 J5.C J7.SLEEVE(S) J8.SLEEVE(S) P1.2 P1.26 P3.2 P3.4 P3.6 P3.8 P4.4 Q21.3(E) R75.1 R77.1 R79.1 U6.8(VSS) U6.19(VSS) U6.27(AVSS) U9.7(GND) U10.7(GND) U11.13(GND) U11.21(GND) U11.22(GND)
VCC: C17.1 J5.8 P1.1 P1.25 P3.7
A: J5.1 U6.3(AN1/VREF-/CN3/RA1) ; port A
B: J5.3 U6.9(OSC1/CLKI/CN30/RA2) ; port B
BL_CNT: Q21.2(B) U6.25(AN10/RTCC/RP14/CN12/PMWR/RB14)
C: J5.4 U6.10(OSC2/CLKO/CN29/PMA0/RA3) ; port C
CLK: J5.2 R76.2 R77.2 U6.4(PGED1/AN2/C2IN-/RP0/CN4/RB0) ; port CLK
CS: P1.19 R79.2
D: J5.5 U6.12(SOSCO/T1CK/CN0/PMA1/RA4) ; port D
D0: P1.3 U9.3(QA)
D1: P1.4 U9.4(QB)
D2: P1.5 U9.5(QC)
D3: P1.6 U9.6(QD)
D4: P1.7 U9.10(QE)
D5: P1.8 U9.11(QF)
D6: P1.9 U9.12(QG)
D7: P1.10 U9.13(QH) U10.1(A) U10.2(B)
D8: P1.11 U10.3(QA)
D9: P1.12 U10.4(QB)
D10: P1.13 U10.5(QC)
D11: P1.14 U10.6(QD)
D12: P1.15 U10.10(QE)
D13: P1.16 U10.11(QF)
D14: P1.17 U10.12(QG)
D15: P1.18 U10.13(QH)
DAT: J5.9 R74.2 R75.2 U6.5(PGEC1/_AN3/C2IN+/RP1/CN5/RB1) ; port DAT
L_OUT: U6.26(AN9/RP15/CN11/PMCS1/RB15)
LAT: J5.6 U6.6(AN4/C1IN-/RP2/CN6/RB2) ; port LAT
LCD_WR: P1.21 U6.7(AN5/C1IN+/RP3/CN7/RB3)
MCLR: P4.1 R58.1 U6.1(~{MCLR})
MIDIRX: U6.22(PGEC2/TMS/RP11/CN15/PMD1/RB11) ; port MIDIRX
MIDIRX2: U6.21(PGED2/TDI/RP10/CN16/PMD2/RB10) U11.1(BT_RX) ; port MIDIRX2  [project net MIDIRX]
MIDITX: U6.18(TDO/SDA1/RP9/CN21/PMD3/RB9) ; port MIDITX
MIDITX2: U6.17(TCK/SCL1/RP8/CN22/PMD4/RB8) U11.2(BT_TX) ; port MIDITX2  [project net MIDITX]
PGCLK: P4.3 R74.1
PGDAT: P4.2 R76.1
RD: P1.22 R78.1
SD_CS: J2.1(CS) U6.11(SOSCI/RP4/CN1/PMBE/RB4)
SPARE: P3.5 U6.23(AN12/RP12/CN14/PMD0/RB12)
SPI_CLK: J2.5(CLK) P1.30 U6.14(PGED3/ASDA1/RP5/CN27/PMD7/RB5) U9.8(CLK) U10.8(CLK)
SPI_MISO: J2.7(MISO) P1.32 U6.15(PGEC3/ASCL1/RP6/CN24/PMD6/RB6)
SPI_MOSI: J2.2(MOSI) P1.20 P1.31 U6.16(INT0/RP7/CN23/PMD5/RB7) U9.1(A) U9.2(B)
TP_CS: P1.29 U6.24(AN11/RP13/CN13/PMRD/RB13)
TP_IRQ: P1.28 R59.1 R66.2 R67.2 R68.1 R69.2 R70.1 R71.1 R72.1 R73.1 U6.2(AN0/VREF+/CN2/RA0)
NetC9_2: C9.2 U6.20(VCAP/VDDCORE)
NetJ7_TIP: J7.TIP(T) P2.3 R66.1
NetJ8_TIP: J8.TIP(T) P2.5 R67.1
NetP1_27: P1.27 Q21.1(C)
NetP2_1: P2.1 R68.2
NetP2_2: P2.2 R70.2
NetP2_4: P2.4 R71.2
NetP2_6: P2.6 R72.2
NetP2_7: P2.7 R69.1
NetP2_8: P2.8 R73.2
NetR62_1: R62.1 U9.9(~{CLR})
NetR80_1: R80.1 U10.9(~{CLR})
NetR81_2: R81.2 U11.11(RESET)

Not connected (* = marked no-connect by the designer): J2 CD WP; P1 24; U11 3(NC) 4(NC) 5(NC) 6(NC) 7(NC) 8(NC) 9(NC) 10(NC) 14(NC) 15(NC) 16(NC) 17(NC) 18(NC) 19(NC) 20(NC) 23(NC) 24(LED) 25(NC) 26(KEY) 27(NC) 28(NC) 29(NC) 30(NC) 31(NC) 32(NC) 33(NC) 34(NC)

### Notes on the sheet
- (near P1) RESET
- (near P1) RS/DC
- TP_SI
- (near P1) TP_SCK
- (near P1) TP_SO
- Microprocessor Board
- A
- AG Funds Music Research

### Library data of the parts
C9 C10 C12 C13 C18 C19 = Cap Semi: Capacitor (Semiconductor SIM Model); Published: 8-Jun-2000; LatestRevisionDate: 29-May-2009; LatestRevisionNote: IPC-7351 Footprint Added.; PackageReference: C1206; Publisher: Altium Limited; PackageDescription: Chip Capacitor
C11 = Cap2: Capacitor; Published: 23-Sep-2002; PackageReference: CAPR5-4X5; Publisher: Altium Limited; PackageDescription: Capacitor; 2 Leads
C17 = Cap Pol1: Polarized Capacitor (Radial); Published: 8-Jun-2000; LatestRevisionDate: 17-Jul-2002; LatestRevisionNote: Re-released for DXP Platform.; PackageReference: RB7.6-15; Publisher: Altium Limited; PackageDescription: Polarized Capacitor (Radial); 2 Leads
J2 = SDCard_SPI: (101-00313) SD-Card Socket Surface Mount Amphenol Shouhmin Industry
J5 = mDIN9: as J1 on sheet LEDArray; Published: 17-Dec-2003; Publisher: Altium Limited; ComponentLink1Description: Manufacturer Link; ComponentLink1URL: http://www.oupiin.com/prodindx.html#Headers
J7 J8 = Phonejack2: Switchcraft RN-111PC Jack Socket, 1/4" [6.5mm], Thru-Hole, 2-Conductor Open Circuit; PackageDocument: 2003; PCB_Layout: Complies with manufacturer's recommendation.; DrillAndSlotSize: Corresponds to nominal value.; LatestRevisionDate: 15-Jul-2004; LatestRevisionNote: Component Replaced.; DatasheetDocument: 2003; PackageReference: S1VS_SNS; Publisher: Altium Limited; ComponentLink1Description: Manufacturer Link; ComponentLink1URL: http://www.cliffuk.co.uk/
P1 = Header 16X2: Header, 16-Pin, Dual row; LatestRevisionDate: 17-Jul-2002; LatestRevisionNote: Re-released for DXP Platform.; Publisher: Altium Limited
P2 P3 = Header 4X2: Header, 4-Pin, Dual row; LatestRevisionDate: 17-Jul-2002; LatestRevisionNote: Re-released for DXP Platform.; Publisher: Altium Limited
P4 = Header 4: Header, 4-Pin; LatestRevisionDate: 17-Jul-2002; LatestRevisionNote: Re-released for DXP Platform.; Publisher: Altium Limited
Q21 = NPN: BC817/BC818 SMD NPN Bipolar Transistor; Published: 8-Jun-2000; LatestRevisionDate: 17-Jul-2002; LatestRevisionNote: Re-released for DXP Platform.; PackageReference: TO-226-AA; Publisher: Altium Limited; PackageDescription: TO, Flat Index; 3 In-Line, Axial Leads; Body Dia. 4.8mm; Leads 0.55 x 0.51 mm (max); Code_JEDEC: TO-226-AA
R58 R59 R62 R66-R81 = Res3: Resistor; Published: 8-Jun-2000; LatestRevisionDate: 29-May-2009; LatestRevisionNote: IPC-7351 Footprint Added.; PackageReference: J1-0603; Publisher: Altium Limited; PackageDescription: Chip Resistor
U6 = PIC24HJ64GP202-I/SO: High Speed General Purpose 16-Bit Flash Microcontroller, 64KB Flash, 8KB RAM, 28-Pin SOIC, Industrial Temperature; Published: 2-Dec-2009; DatasheetVersion: revD, Nov-2009; PackageVersion: revBB, Aug-2009; PackageReference: SOIC-SO28; Publisher: Altium Limited; PackageDescription: 28-Lead Plastic Small Outline (SO) - Wide 7.50mm Body [SOIC]; Supplier 1: Digi-Key; Supplier Part Number 1: PIC24HJ64GP202-I/SO-ND; Supplier 2: Farnell; Supplier Part Number 2: 1576892; Code_JEDEC: MS-013; ComponentLink1Description: Datasheet; ComponentLink1URL: http://ww1.microchip.com/downloads/en/DeviceDoc/70293D.pdf; ComponentLink2Description: Packaging Specification; ComponentLink2URL: http://www.microchip.com/stellent/groups/techpub_sg/documents/packagingspec/en012702.pdf; ComponentLink3Description: Microchip.com Home; ComponentLink3URL: http://www.microchip.com/
U9 U10 = SN74HC164M: 8-Bit Parallel-Out Serial Shift Register; Published: 8-Jun-2000; LatestRevisionDate: 04-Mar-2005; LatestRevisionNote: Stylized 3D Model Added.; DatasheetVersion: May-1997; PackageVersion: Oct-1995; PackageReference: N014; Publisher: Altium Limited; PackageDescription: DIP; 14 Leads; Row Spacing 7.62 mm; Pitch 2.54 mm; ComponentLink1Description: Manufacturer Link; ComponentLink1URL: http://www.ti.com/; ComponentLink2Description: Datasheet; ComponentLink2URL: http://www-s.ti.com/sc/ds/sn74hc164.pdf
U11 = BTModule

## Sheet PowerSupply.SchDoc
size A3
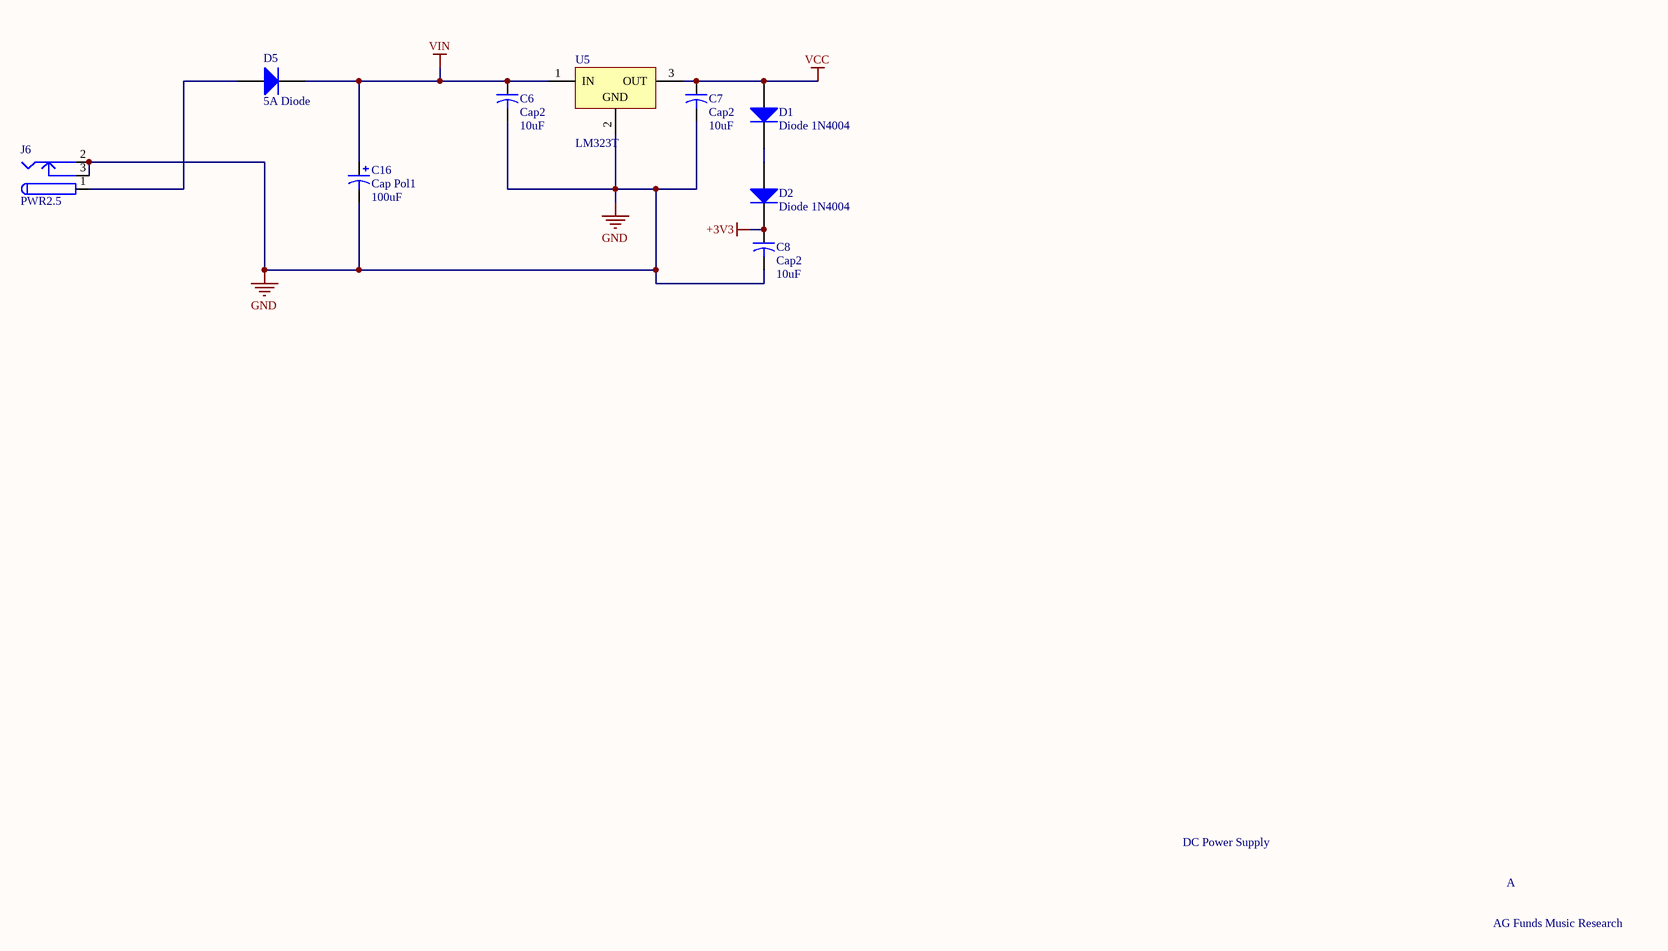
[diagram p5: PowerSupply.SchDoc]

### Parts
C6  Cap2  value 10uF  [CAPR5-4X5]
C7  Cap2  value 10uF  [CAPR5-4X5]
C8  Cap2  value 10uF  [CAPR5-4X5]
C16  Cap Pol1  value 100uF  [RB7.6-15]
D1  Diode 1N4004  [DO-41]
D2  Diode 1N4004  [DO-41]
D5  5A Diode  [DO-201AD]
J6  PWR2.5  [PJ-102B]
U5  LM323T  [TO220ABN]

### Nets
+3V3: C8.1 D2.2(K)
GND: C6.2 C7.2 C8.2 C16.2 J6.2 J6.3 U5.2(GND)
VCC: C7.1 D1.1(A) U5.3(OUT)
VIN: C6.1 C16.1 D5.2(K) U5.1(IN)
NetD1_2: D1.2(K) D2.1(A)
NetD5_1: D5.1(A) J6.1

### Notes on the sheet
- DC Power Supply
- A
- AG Funds Music Research

### Library data of the parts
C6-C8 = Cap2: Capacitor; Published: 23-Sep-2002; PackageReference: CAPR5-4X5; Publisher: Altium Limited; PackageDescription: Capacitor; 2 Leads
C16 = Cap Pol1: Polarized Capacitor (Radial); Published: 8-Jun-2000; LatestRevisionDate: 17-Jul-2002; LatestRevisionNote: Re-released for DXP Platform.; PackageReference: RB7.6-15; Publisher: Altium Limited; PackageDescription: Polarized Capacitor (Radial); 2 Leads
D1 D2 = Diode 1N4004: 1 Amp General Purpose Rectifier; Published: 8-Jun-2000; LatestRevisionDate: 17-Jul-2002; LatestRevisionNote: Re-released for DXP Platform.; DatasheetVersion: 1998; PackageVersion: Aug-1999; PackageReference: DO-41; Publisher: Altium Limited; PackageDescription: Diode, Axial; Body 5.2 x 2.7 mm (LxDia. max), Lead Dia. 0.86 mm (max); Code_JEDEC: DO-204-AL; ComponentLink1Description: Manufacturer Link; ComponentLink1URL: http://www.fairchildsemi.com/; ComponentLink2Description: Datasheet; ComponentLink2URL: http://www.fairchildsemi.com/ds/1N%2F1N4001.pdf
D5 = Diode 1N5404: 3 Amp General Purpose Rectifier; Published: 8-Jun-2000; LatestRevisionDate: 17-Jul-2002; LatestRevisionNote: Re-released for DXP Platform.; DatasheetVersion: 1998; PackageVersion: Aug-1999; PackageReference: DO-201AD; Publisher: Altium Limited; PackageDescription: Diode, Axial; Body 9.5 x 5.6 mm (LxDia. max), Lead Dia. 1.32 mm (max); ComponentLink1Description: Manufacturer Link; ComponentLink1URL: http://www.fairchildsemi.com/; ComponentLink2Description: Datasheet; ComponentLink2URL: http://www.fairchildsemi.com/ds/1N%2F1N5400.pdf
J6 = PWR2.5: CUI Inc. PJ-102B Low Voltage Power Supply Connector; Published: 17-Dec-2003; DatasheetDocument: 09-May-2002; Publisher: Altium Limited; ComponentLink1Description: Manufacturer Link; ComponentLink1URL: http://domino.kycon.com/internet/Products.html
U5 = LM323T: Three Terminal 3A-5V Positive Voltage Regulator; Published: 24-Aug-2001; LatestRevisionDate: 17-Jul-2002; LatestRevisionNote: Re-released for DXP Platform.; DatasheetVersion: Mar-1993; PackageVersion: Jun-1998; PackageReference: TO220ABN; Publisher: Altium Limited; PackageDescription: TO, Thru-Hole, Vertical, Heatsink Mounted; 3 In-Line Leads; Pitch 2.54 mm; Pin sequence 1, 3, 2; ComponentLink1Description: Manufacturer Link; ComponentLink1URL: http://www.st.com/

## Sheet MIDIInterface.SchDoc
size A3
Used 2 times, as channels IO1, IO2. Parts and nets are listed once, with the designators drawn on the sheet.
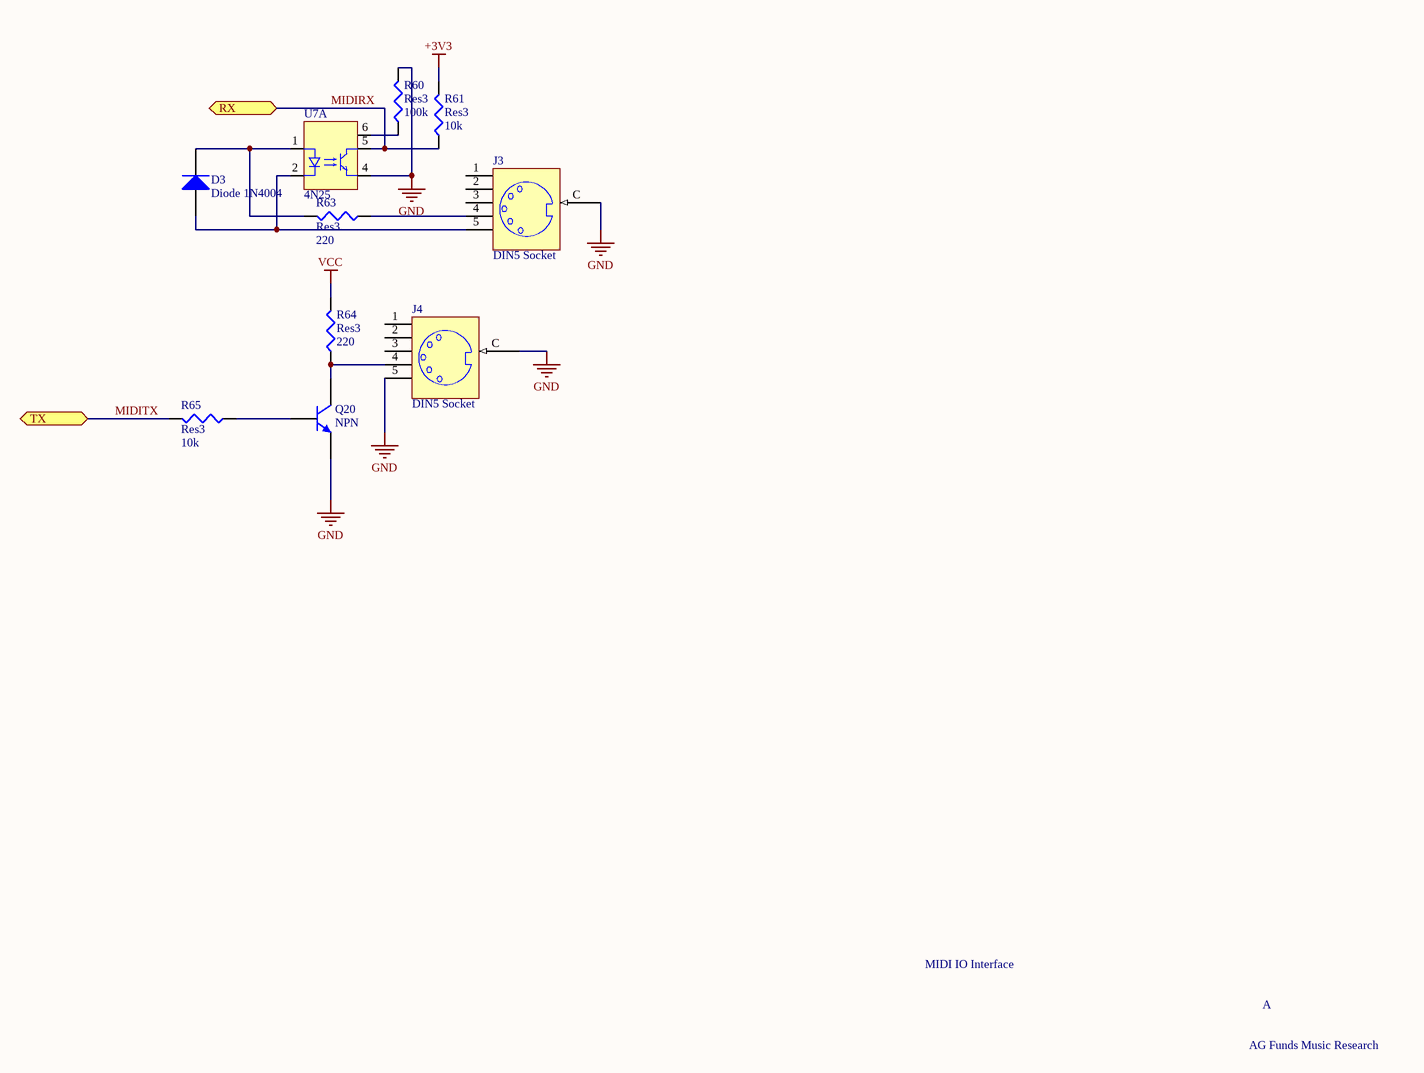
[diagram p6: MIDIInterface.SchDoc]

### Parts
D3  Diode 1N4004  [DO-41]
J3  DIN5 Socket  [DIN-5]
J4  DIN5 Socket  [DIN-5]
Q20  NPN  [SOT95P230-3N]
R60  Res3  value 100k  [J1-0603]
R61  Res3  value 10k  [J1-0603]
R63  Res3  value 220  [J1-0603]
R64  Res3  value 220  [J1-0603]
R65  Res3  value 10k  [J1-0603]
U7  4N25  [DIP-6]  (part A of 2)

### Ports
RX, TX

### Nets
+3V3: R61.2
GND: J3.C J4.5 J4.C Q20.3(E) R60.2 U7.4(E)
VCC: R64.2
MIDIRX: R61.1 U7.5(C) ; port RX
MIDITX: R65.2 ; port TX
NetD3_1: D3.1(A) J3.5 U7.2(K)
NetD3_2: D3.2(K) R63.2 U7.1(A)
NetJ3_4: J3.4 R63.1
NetJ4_4: J4.4 Q20.1(C) R64.1
NetQ20_2: Q20.2(B) R65.1
NetR60_1: R60.1 U7.6(B)

Not connected (* = marked no-connect by the designer): J3 1 2 3; J4 1 2 3

### Channels
IO1: designators end in _IO1; ports RX=MIDIRX TX=MIDITX
IO2: designators end in _IO2; ports RX=MIDIRX TX=MIDITX

### Notes on the sheet
- MIDI IO Interface
- A
- AG Funds Music Research

### Library data of the parts
D3 = Diode 1N4004: 1 Amp General Purpose Rectifier; Published: 8-Jun-2000; LatestRevisionDate: 17-Jul-2002; LatestRevisionNote: Re-released for DXP Platform.; DatasheetVersion: 1998; PackageVersion: Aug-1999; PackageReference: DO-41; Publisher: Altium Limited; PackageDescription: Diode, Axial; Body 5.2 x 2.7 mm (LxDia. max), Lead Dia. 0.86 mm (max); Code_JEDEC: DO-204-AL; ComponentLink1Description: Manufacturer Link; ComponentLink1URL: http://www.fairchildsemi.com/; ComponentLink2Description: Datasheet; ComponentLink2URL: http://www.fairchildsemi.com/ds/1N%2F1N4001.pdf
J3 J4 = DIN5: CUI Inc. SDS-50J DIN5 PCB Mount Socket; Published: 17-Dec-2003; Publisher: Altium Limited; ComponentLink1Description: Manufacturer Link; ComponentLink1URL: http://www.oupiin.com/prodindx.html#Headers
Q20 = NPN: BC817/BC818 SMD NPN Bipolar Transistor; Published: 8-Jun-2000; LatestRevisionDate: 17-Jul-2002; LatestRevisionNote: Re-released for DXP Platform.; PackageReference: TO-226-AA; Publisher: Altium Limited; PackageDescription: TO, Flat Index; 3 In-Line, Axial Leads; Body Dia. 4.8mm; Leads 0.55 x 0.51 mm (max); Code_JEDEC: TO-226-AA
R60 R61 R63-R65 = Res3: Resistor; Published: 8-Jun-2000; LatestRevisionDate: 29-May-2009; LatestRevisionNote: IPC-7351 Footprint Added.; PackageReference: J1-0603; Publisher: Altium Limited; PackageDescription: Chip Resistor
U7 = 4N25: Optocoupler, Phototransistor Output, Dual Channel, TTL Compatible, Pb-free; Note: Transfer Ratio, 35 % Typical; Published: 6-Oct-2005; DatasheetDocument: Rev. 1.4, Oct-2004; PackageDocument: Dec-2003; PackageReference: DIP8; Publisher: Altium Limited; ComponentLink1Description: Manufacturer Link; ComponentLink1URL: http://www.vishay.com/optocouplers/list/product-83640/; ComponentLink2Description: Datasheet; ComponentLink2URL: http://www.vishay.com/docs/83640/83640.pdf

## Nets that join several sheets
+3V3: MainBoard (21 pins), PowerSupply (C8.1 D2.2), IO1 (R61_IO1.2), IO2 (R61_IO2.2)
GND: LEDArray (35 pins), LEDArray/NPNA (8 pins), LEDArray/NPNB (8 pins), LEDArray/NPNC (8 pins), MainBoard (34 pins), PowerSupply (7 pins), IO1 (6 pins), IO2 (6 pins)
VCC: LEDArray (49 pins), LEDArray/NPNA (8 pins), LEDArray/NPNB (8 pins), LEDArray/NPNC (8 pins), MainBoard (5 pins), PowerSupply (C7.1 D1.1 U5.3), IO1 (R64_IO1.2), IO2 (R64_IO2.2)
A: LEDArray (J1.1 U1.1 U8.1), MainBoard (J5.1 U6.3)
B: LEDArray (J1.3 U1.2 U8.2), MainBoard (J5.3 U6.9)
B1: LEDArray (U2.15), LEDArray/NPNA (R3_NPNA.1)
B1: LEDArray (U3.15), LEDArray/NPNB (R3_NPNB.1)
B1: LEDArray (U4.15), LEDArray/NPNC (R3_NPNC.1)
B2: LEDArray (U2.1), LEDArray/NPNA (R6_NPNA.1)
B2: LEDArray (U3.1), LEDArray/NPNB (R6_NPNB.1)
B2: LEDArray (U4.1), LEDArray/NPNC (R6_NPNC.1)
B3: LEDArray (U2.2), LEDArray/NPNA (R9_NPNA.1)
B3: LEDArray (U3.2), LEDArray/NPNB (R9_NPNB.1)
B3: LEDArray (U4.2), LEDArray/NPNC (R9_NPNC.1)
B4: LEDArray (U2.3), LEDArray/NPNA (R12_NPNA.1)
B4: LEDArray (U3.3), LEDArray/NPNB (R12_NPNB.1)
B4: LEDArray (U4.3), LEDArray/NPNC (R12_NPNC.1)
B5: LEDArray (U2.4), LEDArray/NPNA (R15_NPNA.1)
B5: LEDArray (U3.4), LEDArray/NPNB (R15_NPNB.1)
B5: LEDArray (U4.4), LEDArray/NPNC (R15_NPNC.1)
B6: LEDArray (U2.5), LEDArray/NPNA (R18_NPNA.1)
B6: LEDArray (U3.5), LEDArray/NPNB (R18_NPNB.1)
B6: LEDArray (U4.5), LEDArray/NPNC (R18_NPNC.1)
B7: LEDArray (U2.6), LEDArray/NPNA (R21_NPNA.1)
B7: LEDArray (U3.6), LEDArray/NPNB (R21_NPNB.1)
B7: LEDArray (U4.6), LEDArray/NPNC (R21_NPNC.1)
B8: LEDArray (U2.7), LEDArray/NPNA (R24_NPNA.1)
B8: LEDArray (U3.7), LEDArray/NPNB (R24_NPNB.1)
B8: LEDArray (U4.7), LEDArray/NPNC (R24_NPNC.1)
C: LEDArray (J1.4 U1.3 U8.3), MainBoard (J5.4 U6.10)
CLK: LEDArray (J1.2 U2.12 U3.12 U4.12), MainBoard (J5.2 R76.2 R77.2 U6.4)
COM1: LEDArray (Q1.3 R47.2), LEDElement (24 pins)
D: LEDArray (J1.5 U1.4 U1.5 U8.6), MainBoard (J5.5 U6.12)
DAT: LEDArray (J1.9 U2.14), MainBoard (J5.9 R74.2 R75.2 U6.5)
L1: LEDElement (LED1.6), LEDArray/NPNA (R1_NPNA.1)
L2: LEDElement (LED1.4), LEDArray/NPNA (R4_NPNA.1)
L3: LEDElement (LED1.2), LEDArray/NPNA (R7_NPNA.1)
L4: LEDElement (LED2.6), LEDArray/NPNA (R10_NPNA.1)
L5: LEDElement (LED2.4), LEDArray/NPNA (R13_NPNA.1)
L6: LEDElement (LED2.2), LEDArray/NPNA (R16_NPNA.1)
L7: LEDElement (LED3.6), LEDArray/NPNA (R19_NPNA.1)
L8: LEDElement (LED3.4), LEDArray/NPNA (R22_NPNA.1)
L9: LEDElement (LED3.2), LEDArray/NPNB (R1_NPNB.1)
L10: LEDElement (LED4.6), LEDArray/NPNB (R4_NPNB.1)
L11: LEDElement (LED4.4), LEDArray/NPNB (R7_NPNB.1)
L12: LEDElement (LED4.2), LEDArray/NPNB (R10_NPNB.1)
L13: LEDElement (LED5.6), LEDArray/NPNB (R13_NPNB.1)
L14: LEDElement (LED5.4), LEDArray/NPNB (R16_NPNB.1)
L15: LEDElement (LED5.2), LEDArray/NPNB (R19_NPNB.1)
L16: LEDElement (LED6.6), LEDArray/NPNB (R22_NPNB.1)
L17: LEDElement (LED6.4), LEDArray/NPNC (R1_NPNC.1)
L18: LEDElement (LED6.2), LEDArray/NPNC (R4_NPNC.1)
L19: LEDElement (LED7.6), LEDArray/NPNC (R7_NPNC.1)
L20: LEDElement (LED7.4), LEDArray/NPNC (R10_NPNC.1)
L21: LEDElement (LED7.2), LEDArray/NPNC (R13_NPNC.1)
L22: LEDElement (LED8.6), LEDArray/NPNC (R16_NPNC.1)
L23: LEDElement (LED8.4), LEDArray/NPNC (R19_NPNC.1)
L24: LEDElement (LED8.2), LEDArray/NPNC (R22_NPNC.1)
LAT: LEDArray (J1.6 U2.11 U3.11 U4.11), MainBoard (J5.6 U6.6)
MIDIRX: MainBoard (U6.22), IO1 (R61_IO1.1 U7_IO1.5)
MIDIRX: MainBoard (U6.21 U11.1), IO2 (R61_IO2.1 U7_IO2.5)
MIDITX: MainBoard (U6.17 U11.2), IO2 (R65_IO2.2)
MIDITX: MainBoard (U6.18), IO1 (R65_IO1.2)